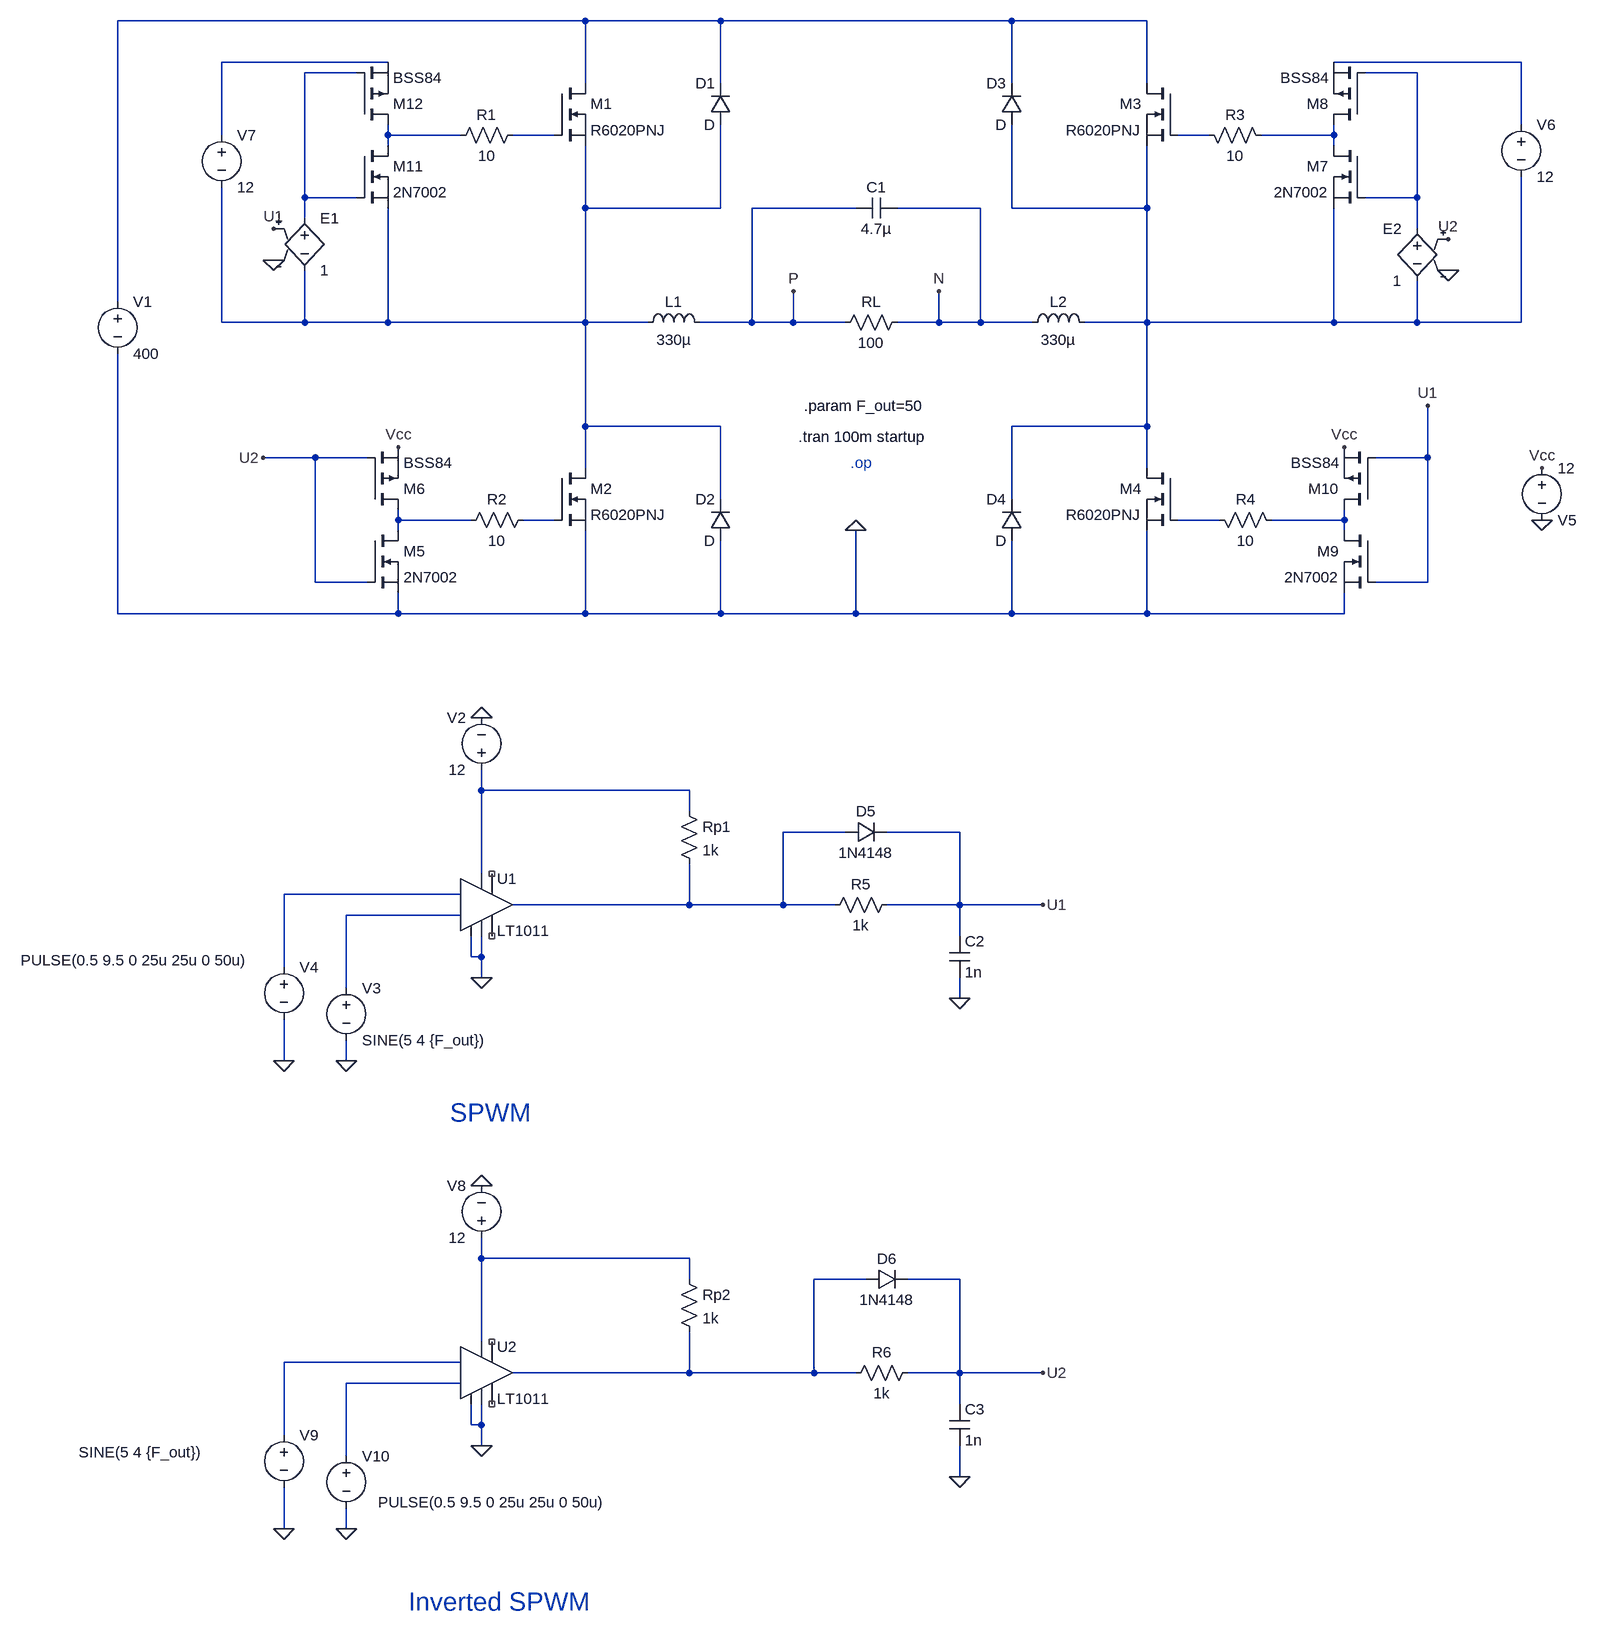
[diagram p0: schematic CMOS_Inverter.asc]
CMOS_Inverter.asc, the LTspice schematic file:
Version 4.1
SHEET 1 1448 1740
WIRE -576 -720 -1296 -720
WIRE -368 -720 -576 -720
WIRE 80 -720 -368 -720
WIRE 288 -720 80 -720
WIRE -880 -656 -1136 -656
WIRE 864 -656 576 -656
WIRE -928 -640 -1008 -640
WIRE 704 -640 624 -640
WIRE -576 -624 -576 -720
WIRE -368 -624 -368 -720
WIRE 80 -624 80 -720
WIRE 288 -624 288 -720
WIRE 864 -560 864 -656
WIRE -1136 -544 -1136 -656
WIRE -880 -544 -880 -560
WIRE -768 -544 -880 -544
WIRE -624 -544 -688 -544
WIRE 384 -544 336 -544
WIRE 576 -544 576 -560
WIRE 576 -544 464 -544
WIRE -880 -528 -880 -544
WIRE 576 -528 576 -544
WIRE -1008 -448 -1008 -640
WIRE -928 -448 -1008 -448
WIRE 704 -448 704 -640
WIRE 704 -448 624 -448
WIRE -576 -432 -576 -528
WIRE -368 -432 -368 -560
WIRE -368 -432 -576 -432
WIRE -160 -432 -320 -432
WIRE 32 -432 -96 -432
WIRE 80 -432 80 -560
WIRE 288 -432 288 -528
WIRE 288 -432 80 -432
WIRE -1008 -416 -1008 -448
WIRE 704 -400 704 -448
WIRE -1296 -288 -1296 -720
WIRE -1136 -256 -1136 -464
WIRE -1008 -256 -1008 -336
WIRE -1008 -256 -1136 -256
WIRE -880 -256 -880 -432
WIRE -880 -256 -1008 -256
WIRE -576 -256 -576 -432
WIRE -576 -256 -880 -256
WIRE -480 -256 -576 -256
WIRE -320 -256 -320 -432
WIRE -320 -256 -400 -256
WIRE -256 -256 -256 -304
WIRE -256 -256 -320 -256
WIRE -176 -256 -256 -256
WIRE -32 -256 -32 -304
WIRE -32 -256 -96 -256
WIRE 32 -256 32 -432
WIRE 32 -256 -32 -256
WIRE 112 -256 32 -256
WIRE 288 -256 288 -432
WIRE 288 -256 192 -256
WIRE 576 -256 576 -432
WIRE 576 -256 288 -256
WIRE 704 -256 704 -320
WIRE 704 -256 576 -256
WIRE 864 -256 864 -480
WIRE 864 -256 704 -256
WIRE -576 -96 -576 -256
WIRE -368 -96 -576 -96
WIRE 288 -96 288 -256
WIRE 288 -96 80 -96
WIRE -992 -48 -1072 -48
WIRE -912 -48 -992 -48
WIRE 720 -48 720 -128
WIRE 720 -48 640 -48
WIRE -576 -32 -576 -96
WIRE 288 -32 288 -96
WIRE -368 16 -368 -96
WIRE 80 16 80 -96
WIRE -864 48 -864 32
WIRE -752 48 -864 48
WIRE -624 48 -672 48
WIRE 400 48 336 48
WIRE 592 48 592 32
WIRE 592 48 480 48
WIRE -864 64 -864 48
WIRE 592 64 592 48
WIRE -992 144 -992 -48
WIRE -912 144 -992 144
WIRE 720 144 720 -48
WIRE 720 144 640 144
WIRE -1296 192 -1296 -208
WIRE -864 192 -864 160
WIRE -864 192 -1296 192
WIRE -576 192 -576 64
WIRE -576 192 -864 192
WIRE -368 192 -368 80
WIRE -368 192 -576 192
WIRE -160 192 -160 64
WIRE -160 192 -368 192
WIRE 80 192 80 80
WIRE 80 192 -160 192
WIRE 288 192 288 64
WIRE 288 192 80 192
WIRE 592 192 592 160
WIRE 592 192 288 192
WIRE -736 464 -736 432
WIRE -416 464 -736 464
WIRE -416 496 -416 464
WIRE -176 528 -272 528
WIRE 0 528 -112 528
WIRE -736 592 -736 464
WIRE -768 624 -1040 624
WIRE -416 640 -416 576
WIRE -416 640 -688 640
WIRE -272 640 -272 528
WIRE -272 640 -416 640
WIRE -192 640 -272 640
WIRE 0 640 0 528
WIRE 0 640 -112 640
WIRE 128 640 0 640
WIRE -768 656 -944 656
WIRE 0 688 0 640
WIRE -752 720 -752 688
WIRE -736 720 -736 688
WIRE -736 720 -752 720
WIRE -1040 736 -1040 624
WIRE -736 752 -736 720
WIRE -944 768 -944 656
WIRE 0 784 0 752
WIRE -1040 880 -1040 816
WIRE -944 880 -944 848
WIRE -736 1184 -736 1152
WIRE -416 1184 -736 1184
WIRE -416 1216 -416 1184
WIRE -144 1216 -224 1216
WIRE 0 1216 -80 1216
WIRE -736 1312 -736 1184
WIRE -768 1344 -1040 1344
WIRE -416 1360 -416 1296
WIRE -416 1360 -688 1360
WIRE -224 1360 -224 1216
WIRE -224 1360 -416 1360
WIRE -160 1360 -224 1360
WIRE 0 1360 0 1216
WIRE 0 1360 -80 1360
WIRE 128 1360 0 1360
WIRE -768 1376 -944 1376
WIRE 0 1408 0 1360
WIRE -752 1440 -752 1408
WIRE -736 1440 -736 1408
WIRE -736 1440 -752 1440
WIRE -1040 1456 -1040 1344
WIRE -736 1472 -736 1440
WIRE -944 1488 -944 1376
WIRE 0 1520 0 1472
WIRE -1040 1600 -1040 1536
WIRE -944 1600 -944 1568
FLAG -160 64 0
FLAG -736 752 0
FLAG -736 352 0
FLAG -944 880 0
FLAG -1040 880 0
FLAG 896 48 0
FLAG 896 -32 Vcc
FLAG -864 -64 Vcc
FLAG 592 -64 Vcc
FLAG -736 1472 0
FLAG -736 1072 0
FLAG -944 1600 0
FLAG -1040 1600 0
FLAG 128 640 U1
FLAG -1056 -400 U1
FLAG 720 -128 U1
FLAG 128 1360 U2
FLAG 752 -384 U2
FLAG -1072 -48 U2
FLAG -256 -304 P
FLAG -32 -304 N
FLAG 0 784 0
FLAG 0 1520 0
FLAG -1056 -352 0
FLAG 752 -336 0
SYMBOL Comparators\\LT1011 -736 640 R0
SYMATTR InstName U1
SYMBOL voltage -1296 -304 R0
WINDOW 123 0 0 Left 0
WINDOW 39 0 0 Left 0
SYMATTR InstName V1
SYMATTR Value 400
SYMBOL diode -352 -560 R180
WINDOW 0 24 64 Left 2
WINDOW 3 24 0 Left 2
SYMATTR InstName D1
SYMBOL diode 96 -560 R180
WINDOW 0 24 64 Left 2
WINDOW 3 24 0 Left 2
SYMATTR InstName D3
SYMBOL diode 96 80 R180
WINDOW 0 24 64 Left 2
WINDOW 3 24 0 Left 2
SYMATTR InstName D4
SYMBOL diode -352 80 R180
WINDOW 0 24 64 Left 2
WINDOW 3 24 0 Left 2
SYMATTR InstName D2
SYMBOL res -80 -272 R90
WINDOW 0 0 56 VBottom 2
WINDOW 3 32 56 VTop 2
SYMATTR InstName RL
SYMATTR Value 100
SYMBOL ind -496 -240 R270
WINDOW 0 32 56 VTop 2
WINDOW 3 5 56 VBottom 2
SYMATTR InstName L1
SYMATTR Value 330µ
SYMATTR SpiceLine Rser=0.1
SYMBOL ind 96 -240 R270
WINDOW 0 32 56 VTop 2
WINDOW 3 5 56 VBottom 2
SYMATTR InstName L2
SYMATTR Value 330µ
SYMATTR SpiceLine Rser=0.1
SYMBOL cap -96 -448 R90
WINDOW 0 0 32 VBottom 2
WINDOW 3 32 32 VTop 2
SYMATTR InstName C1
SYMATTR Value 4.7µ
SYMATTR SpiceLine Rser=0.1
SYMBOL nmos -624 -624 R0
SYMATTR InstName M1
SYMATTR Value R6020PNJ
SYMBOL nmos -624 -32 R0
SYMATTR InstName M2
SYMATTR Value R6020PNJ
SYMBOL nmos 336 -624 M0
SYMATTR InstName M3
SYMATTR Value R6020PNJ
SYMBOL nmos 336 -32 M0
SYMATTR InstName M4
SYMATTR Value R6020PNJ
SYMBOL voltage -736 448 R180
WINDOW 0 24 96 Left 2
WINDOW 3 24 16 Left 2
WINDOW 123 0 0 Left 0
WINDOW 39 0 0 Left 0
SYMATTR InstName V2
SYMATTR Value 12
SYMBOL voltage -944 752 R0
WINDOW 123 0 0 Left 0
WINDOW 39 0 0 Left 0
SYMATTR InstName V3
SYMATTR Value SINE(5 4 {F_out})
SYMBOL voltage -1040 720 R0
WINDOW 3 -405 5 Left 2
WINDOW 123 0 0 Left 0
WINDOW 39 0 0 Left 0
SYMATTR Value PULSE(0.5 9.5 0 25u 25u 0 50u)
SYMATTR InstName V4
SYMBOL res -432 480 R0
SYMATTR InstName Rp1
SYMATTR Value 1k
SYMBOL nmos -912 64 R0
SYMATTR InstName M5
SYMATTR Value 2N7002
SYMBOL pmos -912 32 M180
SYMATTR InstName M6
SYMATTR Value BSS84
SYMBOL res -656 32 R90
WINDOW 0 0 56 VBottom 2
WINDOW 3 32 56 VTop 2
SYMATTR InstName R2
SYMATTR Value 10
SYMBOL voltage 896 -48 R0
WINDOW 0 24 96 Left 2
WINDOW 3 24 16 Left 2
WINDOW 123 0 0 Left 0
WINDOW 39 0 0 Left 0
SYMATTR InstName V5
SYMATTR Value 12
SYMBOL nmos 624 -528 M0
SYMATTR InstName M7
SYMATTR Value 2N7002
SYMBOL pmos 624 -560 R180
SYMATTR InstName M8
SYMATTR Value BSS84
SYMBOL res 368 -560 M90
WINDOW 0 0 56 VBottom 2
WINDOW 3 32 56 VTop 2
SYMATTR InstName R3
SYMATTR Value 10
SYMBOL nmos 640 64 M0
SYMATTR InstName M9
SYMATTR Value 2N7002
SYMBOL pmos 640 32 R180
SYMATTR InstName M10
SYMATTR Value BSS84
SYMBOL res 384 32 M90
WINDOW 0 0 56 VBottom 2
WINDOW 3 32 56 VTop 2
SYMATTR InstName R4
SYMATTR Value 10
SYMBOL nmos -928 -528 R0
SYMATTR InstName M11
SYMATTR Value 2N7002
SYMBOL pmos -928 -560 M180
SYMATTR InstName M12
SYMATTR Value BSS84
SYMBOL res -672 -560 R90
WINDOW 0 0 56 VBottom 2
WINDOW 3 32 56 VTop 2
SYMATTR InstName R1
SYMATTR Value 10
SYMBOL voltage 864 -576 R0
WINDOW 123 0 0 Left 0
WINDOW 39 0 0 Left 0
SYMATTR InstName V6
SYMATTR Value 12
SYMBOL voltage -1136 -560 R0
WINDOW 123 0 0 Left 0
WINDOW 39 0 0 Left 0
SYMATTR InstName V7
SYMATTR Value 12
SYMBOL Comparators\\LT1011 -736 1360 R0
SYMATTR InstName U2
SYMBOL voltage -736 1168 R180
WINDOW 0 24 96 Left 2
WINDOW 3 24 16 Left 2
WINDOW 123 0 0 Left 0
WINDOW 39 0 0 Left 0
SYMATTR InstName V8
SYMATTR Value 12
SYMBOL voltage -1040 1440 R0
WINDOW 123 0 0 Left 0
WINDOW 39 0 0 Left 0
WINDOW 3 -316 42 Left 2
SYMATTR Value SINE(5 4 {F_out})
SYMATTR InstName V9
SYMBOL voltage -944 1472 R0
WINDOW 3 49 87 Left 2
WINDOW 123 0 0 Left 0
WINDOW 39 0 0 Left 0
SYMATTR Value PULSE(0.5 9.5 0 25u 25u 0 50u)
SYMATTR InstName V10
SYMBOL res -432 1200 R0
SYMATTR InstName Rp2
SYMATTR Value 1k
SYMBOL res -96 624 R90
WINDOW 0 0 56 VBottom 2
WINDOW 3 32 56 VTop 2
SYMATTR InstName R5
SYMATTR Value 1k
SYMBOL diode -176 544 R270
WINDOW 0 32 32 VTop 2
WINDOW 3 0 32 VBottom 2
SYMATTR InstName D5
SYMATTR Value 1N4148
SYMBOL cap -16 688 R0
SYMATTR InstName C2
SYMATTR Value 1n
SYMBOL res -176 1376 R270
WINDOW 0 32 56 VTop 2
WINDOW 3 0 56 VBottom 2
SYMATTR InstName R6
SYMATTR Value 1k
SYMBOL diode -144 1232 R270
WINDOW 0 32 32 VTop 2
WINDOW 3 0 32 VBottom 2
SYMATTR InstName D6
SYMATTR Value 1N4148
SYMBOL cap -16 1408 R0
SYMATTR InstName C3
SYMATTR Value 1n
SYMBOL e -1008 -432 R0
SYMATTR InstName E1
SYMATTR Value 1
SYMBOL e 704 -416 M0
SYMATTR InstName E2
SYMATTR Value 1
TEXT -248 -80 Left 2 !.tran 100m startup
TEXT -240 -128 Left 2 !.param F_out=50
TEXT -784 960 Left 4 ;SPWM
TEXT -848 1712 Left 4 ;Inverted SPWM
TEXT -168 -40 Left 2 ;.op

The netlist it stands for:
* CMOS_Inverter.asc
X§U1 0 N019 N018 0 NC_01 NC_02 N017 N016 LT1011
V1 N001 0 400
D1 N010 N001 D
D3 N011 N001 D
D4 0 N011 D
D2 0 N010 D
RL N P 100
L1 N010 P 330µ Rser=0.1
L2 N N011 330µ Rser=0.1
C1 N P 4.7µ Rser=0.1
M1 N001 N007 N010 N010 R6020PNJ
M2 N010 N013 0 0 R6020PNJ
M3 N001 N008 N011 N011 R6020PNJ
M4 N011 N014 0 0 R6020PNJ
V2 N016 0 12
V3 N019 0 SINE(5 4 {F_out})
V4 N018 0 PULSE(0.5 9.5 0 25u 25u 0 50u)
Rp1 N016 N017 1k
M5 N012 U2 0 0 2N7002
M6 N012 U2 Vcc Vcc BSS84
R2 N013 N012 10
V5 Vcc 0 12
M7 N009 N005 N011 N011 2N7002
M8 N009 N005 N003 N003 BSS84
R3 N008 N009 10
M9 N015 U1 0 0 2N7002
M10 N015 U1 Vcc Vcc BSS84
R4 N014 N015 10
M11 N006 N004 N010 N010 2N7002
M12 N006 N004 N002 N002 BSS84
R1 N007 N006 10
V6 N003 N011 12
V7 N002 N010 12
X§U2 0 N023 N022 0 NC_03 NC_04 N021 N020 LT1011
V8 N020 0 12
V9 N022 0 SINE(5 4 {F_out})
V10 N023 0 PULSE(0.5 9.5 0 25u 25u 0 50u)
Rp2 N020 N021 1k
R5 U1 N017 1k
D5 N017 U1 1N4148
C2 U1 0 1n
R6 N021 U2 1k
D6 N021 U2 1N4148
C3 U2 0 1n
E1 N004 N010 U1 0 1
E2 N005 N011 U2 0 1
.model D D
.lib standard.dio
.model NMOS NMOS
.model PMOS PMOS
.lib standard.mos
.tran 100m startup
.param F_out=50
* SPWM
* Inverted SPWM
* .op
.lib LTC1.lib
.backanno
.end